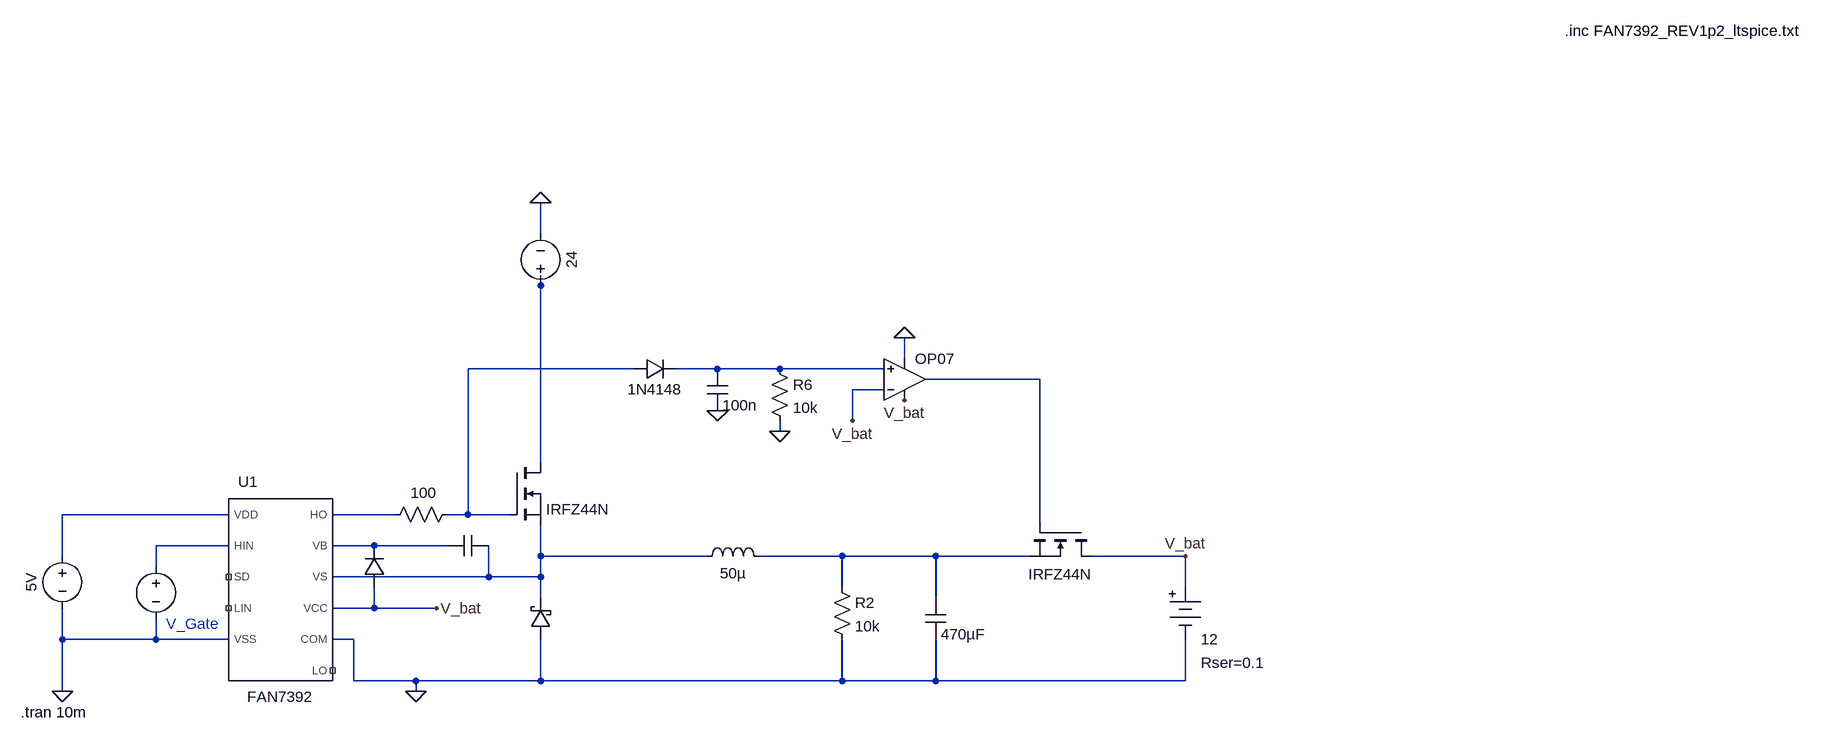
[diagram p0: schematic Isolated Battery (modified).asc]
Isolated Battery (modified).asc, the LTspice schematic file:
Version 4
SHEET 1 6712 680
WIRE 608 -384 608 -432
WIRE 608 -304 608 -320
WIRE 1168 -192 1168 -224
WIRE 752 -176 496 -176
WIRE 880 -176 816 -176
WIRE 976 -176 880 -176
WIRE 1136 -176 976 -176
WIRE 1376 -160 1200 -160
WIRE 1136 -144 1088 -144
WIRE 1088 -96 1088 -144
WIRE 976 -80 976 -96
WIRE 608 -32 608 -304
WIRE 128 48 -128 48
WIRE 384 48 288 48
WIRE 496 48 496 -176
WIRE 496 48 464 48
WIRE 560 48 496 48
WIRE 1376 64 1376 -160
WIRE 128 96 16 96
WIRE 352 96 288 96
WIRE 464 96 352 96
WIRE -128 112 -128 48
WIRE 608 112 608 64
WIRE 864 112 608 112
WIRE 1072 112 944 112
WIRE 1216 112 1072 112
WIRE 1360 112 1216 112
WIRE 1600 112 1456 112
WIRE 16 128 16 96
WIRE 528 144 528 96
WIRE 528 144 288 144
WIRE 608 144 608 112
WIRE 608 144 528 144
WIRE 1072 160 1072 112
WIRE 1600 160 1600 112
WIRE 608 176 608 144
WIRE 1216 176 1216 112
WIRE 352 192 352 160
WIRE 352 192 288 192
WIRE 448 192 352 192
WIRE -128 240 -128 192
WIRE 16 240 16 208
WIRE 16 240 -128 240
WIRE 128 240 16 240
WIRE 320 240 288 240
WIRE 320 304 320 240
WIRE 416 304 320 304
WIRE 608 304 608 240
WIRE 608 304 416 304
WIRE 1072 304 1072 240
WIRE 1072 304 608 304
WIRE 1216 304 1216 240
WIRE 1216 304 1072 304
WIRE 1600 304 1600 240
WIRE 1600 304 1216 304
WIRE -128 320 -128 240
WIRE 416 320 416 304
FLAG 416 320 0
FLAG 608 -432 0
FLAG -128 320 0
FLAG 448 192 V_bat
FLAG 1600 112 V_bat
FLAG 1088 -96 V_bat
FLAG 880 -112 0
FLAG 976 -80 0
FLAG 1168 -128 V_bat
FLAG 1168 -224 0
SYMBOL Gate\ drivers\\FAN7392 208 160 R0
SYMATTR InstName U1
SYMBOL nmos 560 -32 R0
WINDOW 0 56 32 Invisible 2
SYMATTR InstName M1
SYMATTR Value IRFZ44N
SYMBOL res 480 32 R90
WINDOW 0 0 56 Invisible 2
WINDOW 3 -33 52 VTop 2
SYMATTR InstName R1
SYMATTR Value 100
SYMBOL ind 848 128 R270
WINDOW 0 32 56 Invisible 2
WINDOW 3 5 56 VBottom 2
SYMATTR InstName L1
SYMATTR Value 50µ
SYMBOL cap 528 80 R90
WINDOW 0 0 32 Invisible 2
WINDOW 3 32 32 Invisible 2
SYMATTR InstName C1
SYMATTR Value 10µF
SYMBOL voltage 608 -288 R180
WINDOW 0 32 56 Invisible 2
WINDOW 3 -32 56 VBottom 2
WINDOW 123 0 0 Left 0
WINDOW 39 0 0 Left 0
SYMATTR InstName V2
SYMATTR Value 24
SYMBOL voltage -128 96 R0
WINDOW 0 32 56 Invisible 2
WINDOW 3 -32 56 VBottom 2
WINDOW 123 0 0 Left 0
WINDOW 39 0 0 Left 0
SYMATTR InstName V3
SYMATTR Value 5V
SYMBOL voltage 16 112 R0
WINDOW 0 24 16 Invisible 2
WINDOW 3 24 96 Invisible 2
WINDOW 123 0 0 Left 0
WINDOW 39 0 0 Left 0
SYMATTR InstName V4
SYMATTR Value PULSE(0 5v 1n 1n 1n 10.5u 20u)
SYMBOL cap 1200 176 R0
WINDOW 0 24 8 Invisible 2
SYMATTR InstName C2
SYMATTR Value 470µF
SYMBOL diode 368 160 R180
WINDOW 0 24 64 Invisible 2
WINDOW 3 24 0 Invisible 2
SYMATTR InstName D1
SYMATTR Value 1N4148
SYMBOL schottky 624 240 R180
WINDOW 0 24 64 Invisible 2
WINDOW 3 24 0 Invisible 2
SYMATTR InstName D2
SYMATTR Value RBR3LAM30A
SYMATTR Description Diode
SYMATTR Type diode
SYMBOL Misc\\battery 1600 144 R0
WINDOW 0 24 16 Invisible 2
WINDOW 123 0 0 Left 0
WINDOW 39 24 132 Left 2
SYMATTR InstName V1
SYMATTR Value 12
SYMATTR SpiceLine Rser=0.1
SYMBOL OpAmps\\OP07 1168 -96 M180
WINDOW 0 16 32 Invisible 2
SYMATTR InstName U3
SYMBOL diode 752 -160 R270
WINDOW 0 32 32 Invisible 2
WINDOW 3 0 32 VBottom 2
SYMATTR InstName D3
SYMATTR Value 1N4148
SYMBOL cap 864 -176 R0
WINDOW 0 24 8 Invisible 2
SYMATTR InstName C4
SYMATTR Value 100n
SYMBOL res 960 -192 R0
SYMATTR InstName R6
SYMATTR Value 10k
SYMBOL res 1056 144 R0
SYMATTR InstName R2
SYMATTR Value 10k
SYMBOL nmos 1456 64 R90
WINDOW 0 56 32 Invisible 2
WINDOW 3 76 48 VCenter 2
SYMATTR InstName M2
SYMATTR Value IRFZ44N
TEXT 2184 -696 Left 2 !.inc FAN7392_REV1p2_ltspice.txt
TEXT -192 352 Left 2 !.tran 10m
TEXT 32 216 Left 2 ;V_Gate

The netlist it stands for:
* Isolated Battery (modified).asc
XU1 V_bat 0 N007 NC_01 N005 N008 N009 N006 0 NC_02 NC_03 FAN7392  ; pins VCC COM HIN LIN VDD VB VS HO VSS SD LO
M1 N001 N002 N009 N009 IRFZ44N
R1 N002 N006 100
L1 N009 N010 50µ
C1 N009 N008 10µF
V2 N001 0 24
V3 N005 0 5V
V4 N007 0 PULSE(0 5v 1n 1n 1n 10.5u 20u)
C2 N010 0 470µF
D1 V_bat N008 1N4148
D2 0 N009 RBR3LAM30A
V1 V_bat 0 12 Rser=0.1
XU3 N003 V_bat V_bat 0 N004 LT1001  ; OP07, pins In+ In- V+ V- OUT
D3 N002 N003 1N4148
C4 N003 0 100n
R6 N003 0 10k
R2 N010 0 10k
M2 V_bat N004 N010 N010 IRFZ44N
.model D D
.lib standard.dio
.model NMOS NMOS
.model PMOS PMOS
.lib standard.mos
.inc FAN7392_REV1p2_ltspice.txt
.tran 10m
* V_Gate
.lib LTC.lib
.backanno
.end